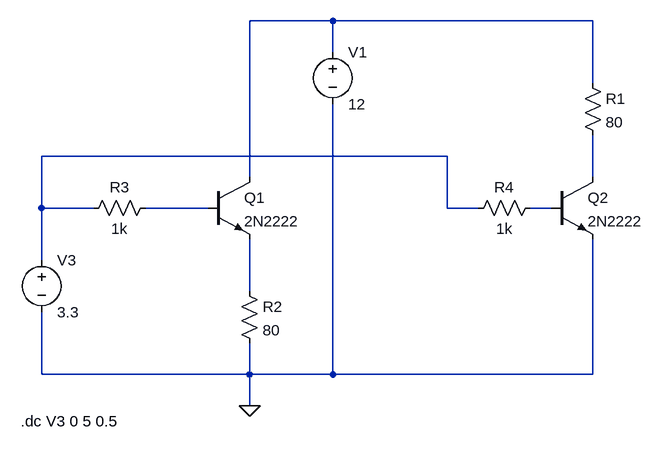
[diagram p0: schematic Draft1.asc]
Draft1.asc, the LTspice schematic file:
Version 4
SHEET 1 952 680
WIRE 384 -80 256 -80
WIRE 784 -80 384 -80
WIRE 384 -32 384 -80
WIRE 784 16 784 -80
WIRE 560 128 -64 128
WIRE 256 160 256 -80
WIRE 784 160 784 96
WIRE -64 208 -64 128
WIRE 16 208 -64 208
WIRE 192 208 96 208
WIRE 560 208 560 128
WIRE 608 208 560 208
WIRE 720 208 688 208
WIRE -64 288 -64 208
WIRE 256 336 256 256
WIRE -64 464 -64 368
WIRE 256 464 256 416
WIRE 256 464 -64 464
WIRE 384 464 384 48
WIRE 384 464 256 464
WIRE 784 464 784 256
WIRE 784 464 384 464
WIRE 256 512 256 464
FLAG 256 512 0
SYMBOL npn 192 160 R0
SYMATTR InstName Q1
SYMATTR Value 2N2222
SYMBOL res 240 320 R0
SYMATTR InstName R2
SYMATTR Value 80
SYMBOL voltage 384 -48 R0
WINDOW 123 0 0 Left 0
WINDOW 39 0 0 Left 0
SYMATTR InstName V1
SYMATTR Value 12
SYMBOL res 0 224 R270
WINDOW 0 32 56 VTop 2
WINDOW 3 0 56 VBottom 2
SYMATTR InstName R3
SYMATTR Value 1k
SYMBOL npn 720 160 R0
SYMATTR InstName Q2
SYMATTR Value 2N2222
SYMBOL res 768 0 R0
SYMATTR InstName R1
SYMATTR Value 80
SYMBOL res 592 224 R270
WINDOW 0 32 56 VTop 2
WINDOW 3 0 56 VBottom 2
SYMATTR InstName R4
SYMATTR Value 1k
SYMBOL voltage -64 272 R0
WINDOW 123 0 0 Left 0
WINDOW 39 0 0 Left 0
SYMATTR InstName V3
SYMATTR Value 3.3
TEXT -96 536 Left 2 !.dc V3 0 5 0.5

The netlist it stands for:
* Draft1.asc
Q1 N001 N004 N006 0 2N2222
R2 N006 0 80
V1 N001 0 12
R3 N002 N004 1k
Q2 N003 N005 0 0 2N2222
R1 N001 N003 80
R4 N002 N005 1k
V3 N002 0 3.3
.model NPN NPN
.model PNP PNP
.lib standard.bjt
.dc V3 0 5 0.5
.backanno
.end